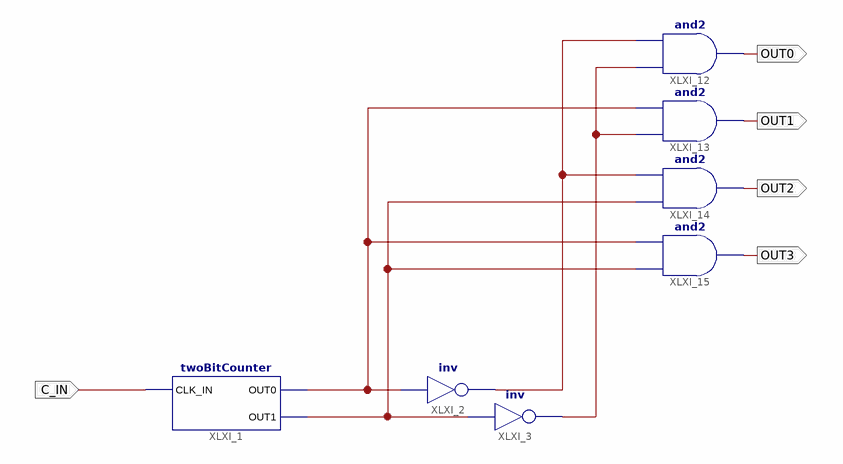
[diagram p0: schematic sheet 1]
// Xilinx ISE schematic demux1to4.sch (spartan6) as structural Verilog: 7 symbols, 5 ports
module demux1to4 (
  input  C_IN,
  output OUT0,
  output OUT1,
  output OUT2,
  output OUT3
);

  wire XLXN_2, XLXN_18, XLXN_19, XLXN_25;

  twoBitCounter XLXI_1 (.CLK_IN(C_IN), .OUT0(XLXN_2), .OUT1(XLXN_25));
  not XLXI_2 (XLXN_18, XLXN_2);
  not XLXI_3 (XLXN_19, XLXN_25);
  and XLXI_12 (OUT0, XLXN_19, XLXN_18);
  and XLXI_13 (OUT1, XLXN_19, XLXN_2);
  and XLXI_14 (OUT2, XLXN_25, XLXN_18);
  and XLXI_15 (OUT3, XLXN_25, XLXN_2);
endmodule
